# EAGLE design Bozarth_Mode (EAGLE 7.6.0)
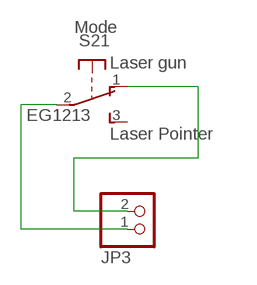
[diagram p0: schematic, sheet 1]

## Parts
JP3  PINHD-1X2  [1X02]
S2  EG1213  [EG1213]

## Nets
N$1: JP3.2 S2.1(1:O)
N$2: JP3.1 S2.2(1:P)
Unconnected: S2.3(1:S) S2.MT1(MT) S2.MT2(MT)

## Notes on the sheet
- Mode
- Laser gun
- Laser Pointer

## Library data of the parts
JP3 = pinhead:PINHD-1X2: PIN HEADER
S2 = adafruit:EG1213: E-Switch right-angle slide SPDT Part #EG1213 http://www.ladyada.net/library/eagle

## Board
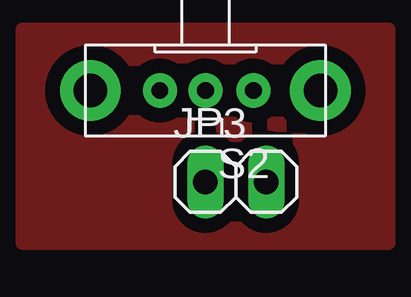
[diagram p1: board, top side]
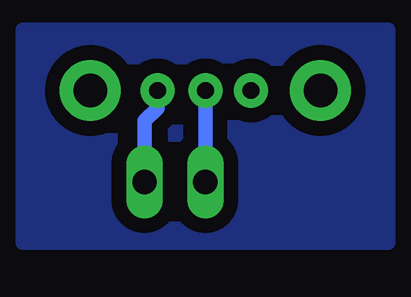
[diagram p2: board, bottom side, seen from below]

No outline drawn. Coordinates in mm, seen from the top.
Copper layers (1*16): Top 0.035mm / dielectric 1.5mm / Bottom 0.035mm
Design rules "default": minimum track width 10mil, minimum drill 0.6mm, track to track 8mil, track to pad 8mil, pad to pad 8mil, via to via 8mil, smd to smd 8mil, copper to edge 40mil, drill to drill 8mil, minimum pad ring 10mil, minimum via ring 8mil, stop-mask expansion 4mil, vias tented up to drill 0mil, thermal gap 10mil

### Footprints (pad centres in the part's own frame; a part is rotated, then mirrored left to right if it is on the bottom)
1X02 = drill 1.016 long: 1 -1.27,0; 2 1.27,0
EG1213 = drill 0.7 pad 1.422: 1 -2,0; 2 0,0; 3 1.9,0 | drill 1.4 pad 2.54: MT1 -4.8,0; MT2 4.8,0

### Placement (x,y rotation side)
JP3  8.89,3.81 0 top
S2  7.62,7.62 180 top

### Tracks (layer width: path | path; a pad name or v marks a point on that pad's centre or on a via)
GND
  pour Top (isolate 0.61): 0,10.16 15.24,10.16 15.24,1.27 0,1.27
  pour Bottom (isolate 0.61): 0,10.16 15.24,10.16 15.24,1.27 0,1.27
N$1
  Bottom 0.61: S2.1 9.62,6.89 10.16,6.35 JP3.2
N$2
  Bottom 0.61: JP3.1 S2.2